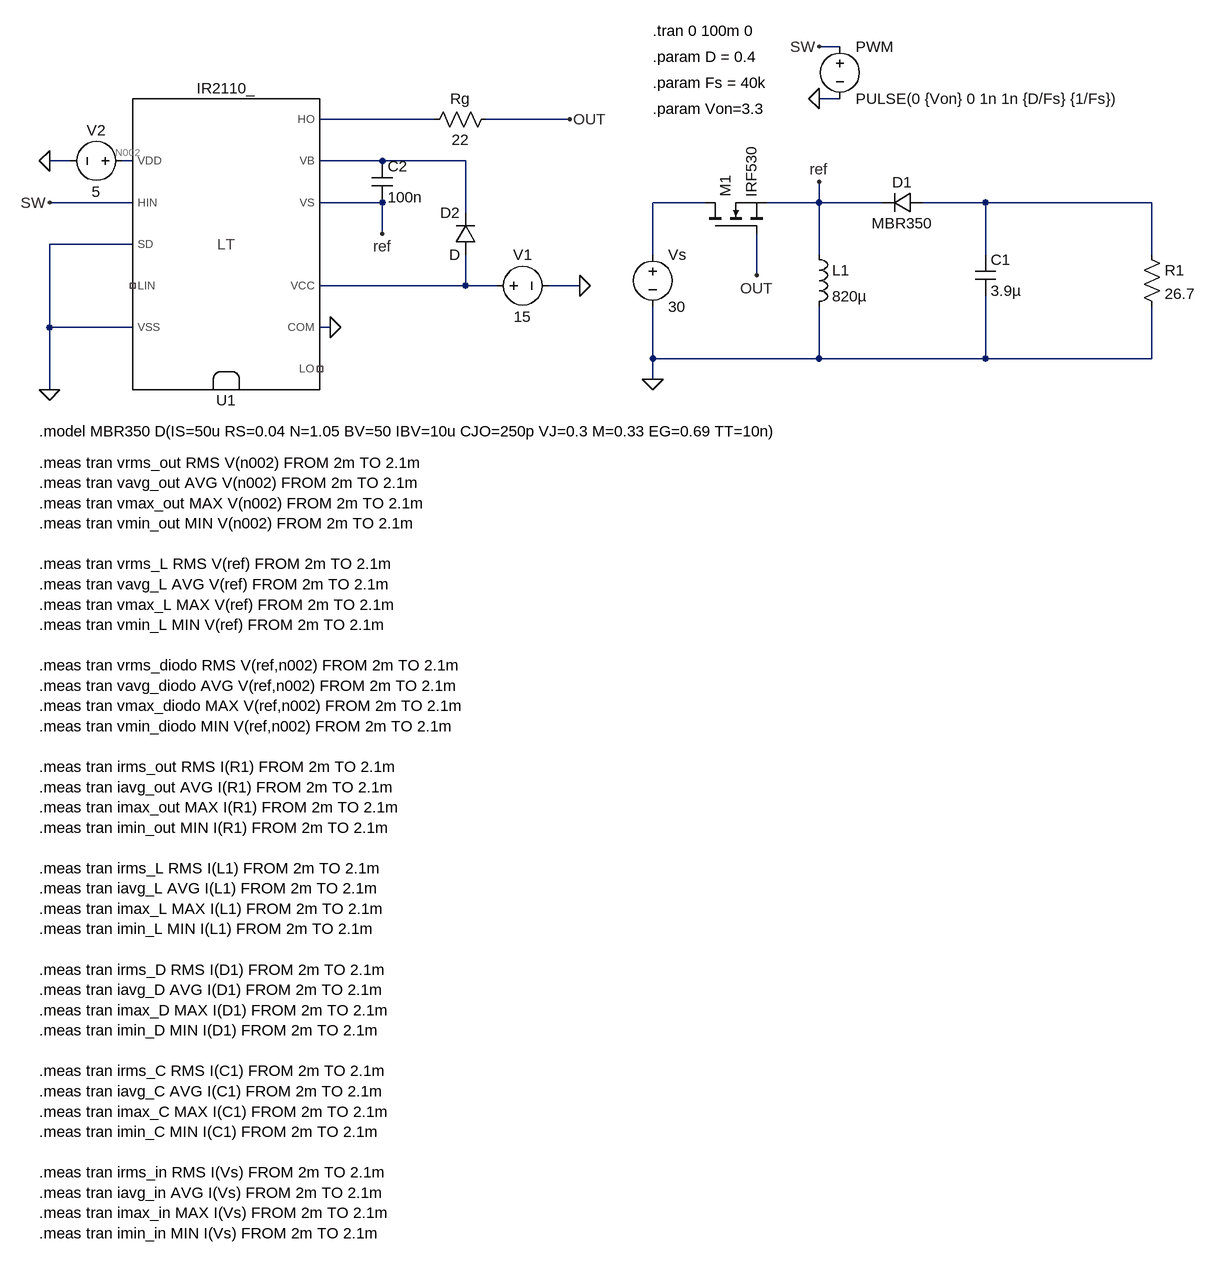
[diagram p0: schematic final_BuckBoost.asc]
final_BuckBoost.asc, the LTspice schematic file:
Version 4
SHEET 1 1064 1776
WIRE -1312 -864 -1344 -864
WIRE -1312 -784 -1344 -784
WIRE -1936 -752 -2112 -752
WIRE -1728 -752 -1856 -752
WIRE -2496 -688 -2528 -688
WIRE -2400 -688 -2416 -688
WIRE -2016 -688 -2112 -688
WIRE -1888 -688 -2016 -688
WIRE -2400 -624 -2528 -624
WIRE -2016 -624 -2112 -624
WIRE -1520 -624 -1600 -624
WIRE -1344 -624 -1344 -656
WIRE -1344 -624 -1424 -624
WIRE -1248 -624 -1344 -624
WIRE -1088 -624 -1184 -624
WIRE -832 -624 -1088 -624
WIRE -1888 -608 -1888 -688
WIRE -2016 -576 -2016 -624
WIRE -2400 -560 -2528 -560
WIRE -1600 -544 -1600 -624
WIRE -1344 -544 -1344 -624
WIRE -1088 -544 -1088 -624
WIRE -832 -544 -832 -624
WIRE -1440 -512 -1440 -576
WIRE -1888 -496 -1888 -544
WIRE -1888 -496 -2112 -496
WIRE -1840 -496 -1888 -496
WIRE -1712 -496 -1760 -496
WIRE -2528 -432 -2528 -560
WIRE -2400 -432 -2528 -432
WIRE -2096 -432 -2112 -432
WIRE -1600 -384 -1600 -464
WIRE -1344 -384 -1344 -464
WIRE -1344 -384 -1600 -384
WIRE -1088 -384 -1088 -480
WIRE -1088 -384 -1344 -384
WIRE -832 -384 -832 -464
WIRE -832 -384 -1088 -384
WIRE -1600 -352 -1600 -384
WIRE -2528 -336 -2528 -432
FLAG -1344 -864 SW
FLAG -1440 -512 OUT
FLAG -1600 -352 0
FLAG -2096 -432 0
FLAG -1712 -496 0
FLAG -1344 -784 0
FLAG -2528 -624 SW
FLAG -2528 -336 0
FLAG -2528 -688 0
FLAG -1728 -752 OUT
FLAG -2016 -576 ref
FLAG -1344 -656 ref
SYMBOL voltage -1312 -880 R0
WINDOW 123 0 0 Left 0
WINDOW 39 0 0 Left 0
SYMATTR InstName PWM
SYMATTR Value PULSE(0 {Von} 0 1n 1n {D/Fs} {1/Fs})
SYMBOL voltage -1600 -560 R0
SYMATTR InstName Vs
SYMATTR Value 30
SYMBOL ind -1360 -560 R0
SYMATTR InstName L1
SYMATTR Value 820µ
SYMBOL cap -1104 -544 R0
SYMATTR InstName C1
SYMATTR Value 3.9µ
SYMBOL res -848 -560 R0
SYMATTR InstName R1
SYMATTR Value 26.7
SYMBOL diode -1184 -640 R90
WINDOW 0 0 32 VBottom 2
WINDOW 3 32 32 VTop 2
SYMATTR InstName D1
SYMATTR Value MBR350
SYMBOL nmos -1520 -576 R270
SYMATTR InstName M1
SYMATTR Value IRF530
SYMBOL IR2110_ -2256 -560 R0
SYMATTR InstName U1
SYMBOL cap -2032 -688 R0
SYMATTR InstName C2
SYMATTR Value 100n
SYMBOL diode -1872 -544 R180
WINDOW 0 24 64 Left 2
WINDOW 3 24 0 Left 2
SYMATTR InstName D2
SYMBOL voltage -1856 -496 R270
WINDOW 0 32 56 VTop 2
WINDOW 3 -32 56 VBottom 2
SYMATTR InstName V1
SYMATTR Value 15
SYMBOL res -1840 -768 R90
WINDOW 0 0 56 VBottom 2
WINDOW 3 32 56 VTop 2
SYMATTR InstName Rg
SYMATTR Value 22
SYMBOL voltage -2400 -688 R90
WINDOW 0 -32 56 VBottom 2
WINDOW 3 32 56 VTop 2
SYMATTR InstName V2
SYMATTR Value 5
TEXT -1600 -848 Left 2 !.param D = 0.4
TEXT -1600 -808 Left 2 !.param Fs = 40k
TEXT -1600 -888 Left 2 !.tran 0 100m 0
TEXT -1600 -768 Left 2 !.param Von=3.3
TEXT -2544 -272 Left 2 !.model MBR350 D(IS=50u RS=0.04 N=1.05 BV=50 IBV=10u CJO=250p VJ=0.3 M=0.33 EG=0.69 TT=10n)
TEXT -2544 -224 Left 2 !.meas tran vrms_out RMS V(n002) FROM 2m TO 2.1m\n.meas tran vavg_out AVG V(n002) FROM 2m TO 2.1m\n.meas tran vmax_out MAX V(n002) FROM 2m TO 2.1m\n.meas tran vmin_out MIN V(n002) FROM 2m TO 2.1m\n \n.meas tran vrms_L RMS V(ref) FROM 2m TO 2.1m\n.meas tran vavg_L AVG V(ref) FROM 2m TO 2.1m\n.meas tran vmax_L MAX V(ref) FROM 2m TO 2.1m\n.meas tran vmin_L MIN V(ref) FROM 2m TO 2.1m\n \n.meas tran vrms_diodo RMS V(ref,n002) FROM 2m TO 2.1m\n.meas tran vavg_diodo AVG V(ref,n002) FROM 2m TO 2.1m\n.meas tran vmax_diodo MAX V(ref,n002) FROM 2m TO 2.1m\n.meas tran vmin_diodo MIN V(ref,n002) FROM 2m TO 2.1m\n \n.meas tran irms_out RMS I(R1) FROM 2m TO 2.1m\n.meas tran iavg_out AVG I(R1) FROM 2m TO 2.1m\n.meas tran imax_out MAX I(R1) FROM 2m TO 2.1m\n.meas tran imin_out MIN I(R1) FROM 2m TO 2.1m \n \n.meas tran irms_L RMS I(L1) FROM 2m TO 2.1m\n.meas tran iavg_L AVG I(L1) FROM 2m TO 2.1m\n.meas tran imax_L MAX I(L1) FROM 2m TO 2.1m\n.meas tran imin_L MIN I(L1) FROM 2m TO 2.1m\n \n.meas tran irms_D RMS I(D1) FROM 2m TO 2.1m\n.meas tran iavg_D AVG I(D1) FROM 2m TO 2.1m\n.meas tran imax_D MAX I(D1) FROM 2m TO 2.1m\n.meas tran imin_D MIN I(D1) FROM 2m TO 2.1m\n \n.meas tran irms_C RMS I(C1) FROM 2m TO 2.1m\n.meas tran iavg_C AVG I(C1) FROM 2m TO 2.1m\n.meas tran imax_C MAX I(C1) FROM 2m TO 2.1m\n.meas tran imin_C MIN I(C1) FROM 2m TO 2.1m\n \n.meas tran irms_in RMS I(Vs) FROM 2m TO 2.1m\n.meas tran iavg_in AVG I(Vs) FROM 2m TO 2.1m\n.meas tran imax_in MAX I(Vs) FROM 2m TO 2.1m\n.meas tran imin_in MIN I(Vs) FROM 2m TO 2.1m

The netlist it stands for:
* final_BuckBoost.asc
V§PWM SW 0 PULSE(0 {Von} 0 1n 1n {D/Fs} {1/Fs})
Vs N004 0 30
L1 ref 0 820µ
C1 N005 0 3.9µ
R1 N005 0 26.7
D1 N005 ref MBR350
M1 N004 OUT ref ref IRF530
XU1 N002 SW 0 NC_01 0 N001 N003 ref N006 0 NC_02 IR2110_  ; pins VDD HIN SD LIN VSS HO VB VS VCC COM LO
C2 N003 ref 100n
D2 N006 N003 D
V1 N006 0 15
Rg OUT N001 22
V2 N002 0 5
.model D D
.lib standard.dio
.model NMOS NMOS
.model PMOS PMOS
.lib standard.mos
.param D = 0.4
.param Fs = 40k
.tran 0 100m 0
.param Von=3.3
.model MBR350 D(IS=50u RS=0.04 N=1.05 BV=50 IBV=10u CJO=250p VJ=0.3 M=0.33 EG=0.69 TT=10n)
.meas tran vrms_out RMS V(n002) FROM 2m TO 2.1m
.meas tran vavg_out AVG V(n002) FROM 2m TO 2.1m
.meas tran vmax_out MAX V(n002) FROM 2m TO 2.1m
.meas tran vmin_out MIN V(n002) FROM 2m TO 2.1m
.meas tran vrms_L RMS V(ref) FROM 2m TO 2.1m
.meas tran vavg_L AVG V(ref) FROM 2m TO 2.1m
.meas tran vmax_L MAX V(ref) FROM 2m TO 2.1m
.meas tran vmin_L MIN V(ref) FROM 2m TO 2.1m
.meas tran vrms_diodo RMS V(ref,n002) FROM 2m TO 2.1m
.meas tran vavg_diodo AVG V(ref,n002) FROM 2m TO 2.1m
.meas tran vmax_diodo MAX V(ref,n002) FROM 2m TO 2.1m
.meas tran vmin_diodo MIN V(ref,n002) FROM 2m TO 2.1m
.meas tran irms_out RMS I(R1) FROM 2m TO 2.1m
.meas tran iavg_out AVG I(R1) FROM 2m TO 2.1m
.meas tran imax_out MAX I(R1) FROM 2m TO 2.1m
.meas tran imin_out MIN I(R1) FROM 2m TO 2.1m
.meas tran irms_L RMS I(L1) FROM 2m TO 2.1m
.meas tran iavg_L AVG I(L1) FROM 2m TO 2.1m
.meas tran imax_L MAX I(L1) FROM 2m TO 2.1m
.meas tran imin_L MIN I(L1) FROM 2m TO 2.1m
.meas tran irms_D RMS I(D1) FROM 2m TO 2.1m
.meas tran iavg_D AVG I(D1) FROM 2m TO 2.1m
.meas tran imax_D MAX I(D1) FROM 2m TO 2.1m
.meas tran imin_D MIN I(D1) FROM 2m TO 2.1m
.meas tran irms_C RMS I(C1) FROM 2m TO 2.1m
.meas tran iavg_C AVG I(C1) FROM 2m TO 2.1m
.meas tran imax_C MAX I(C1) FROM 2m TO 2.1m
.meas tran imin_C MIN I(C1) FROM 2m TO 2.1m
.meas tran irms_in RMS I(Vs) FROM 2m TO 2.1m
.meas tran iavg_in AVG I(Vs) FROM 2m TO 2.1m
.meas tran imax_in MAX I(Vs) FROM 2m TO 2.1m
.meas tran imin_in MIN I(Vs) FROM 2m TO 2.1m
.lib IR2110_.lib
.backanno
.end